# EAGLE design AP-Taster_V3.3 (EAGLE 6.3)
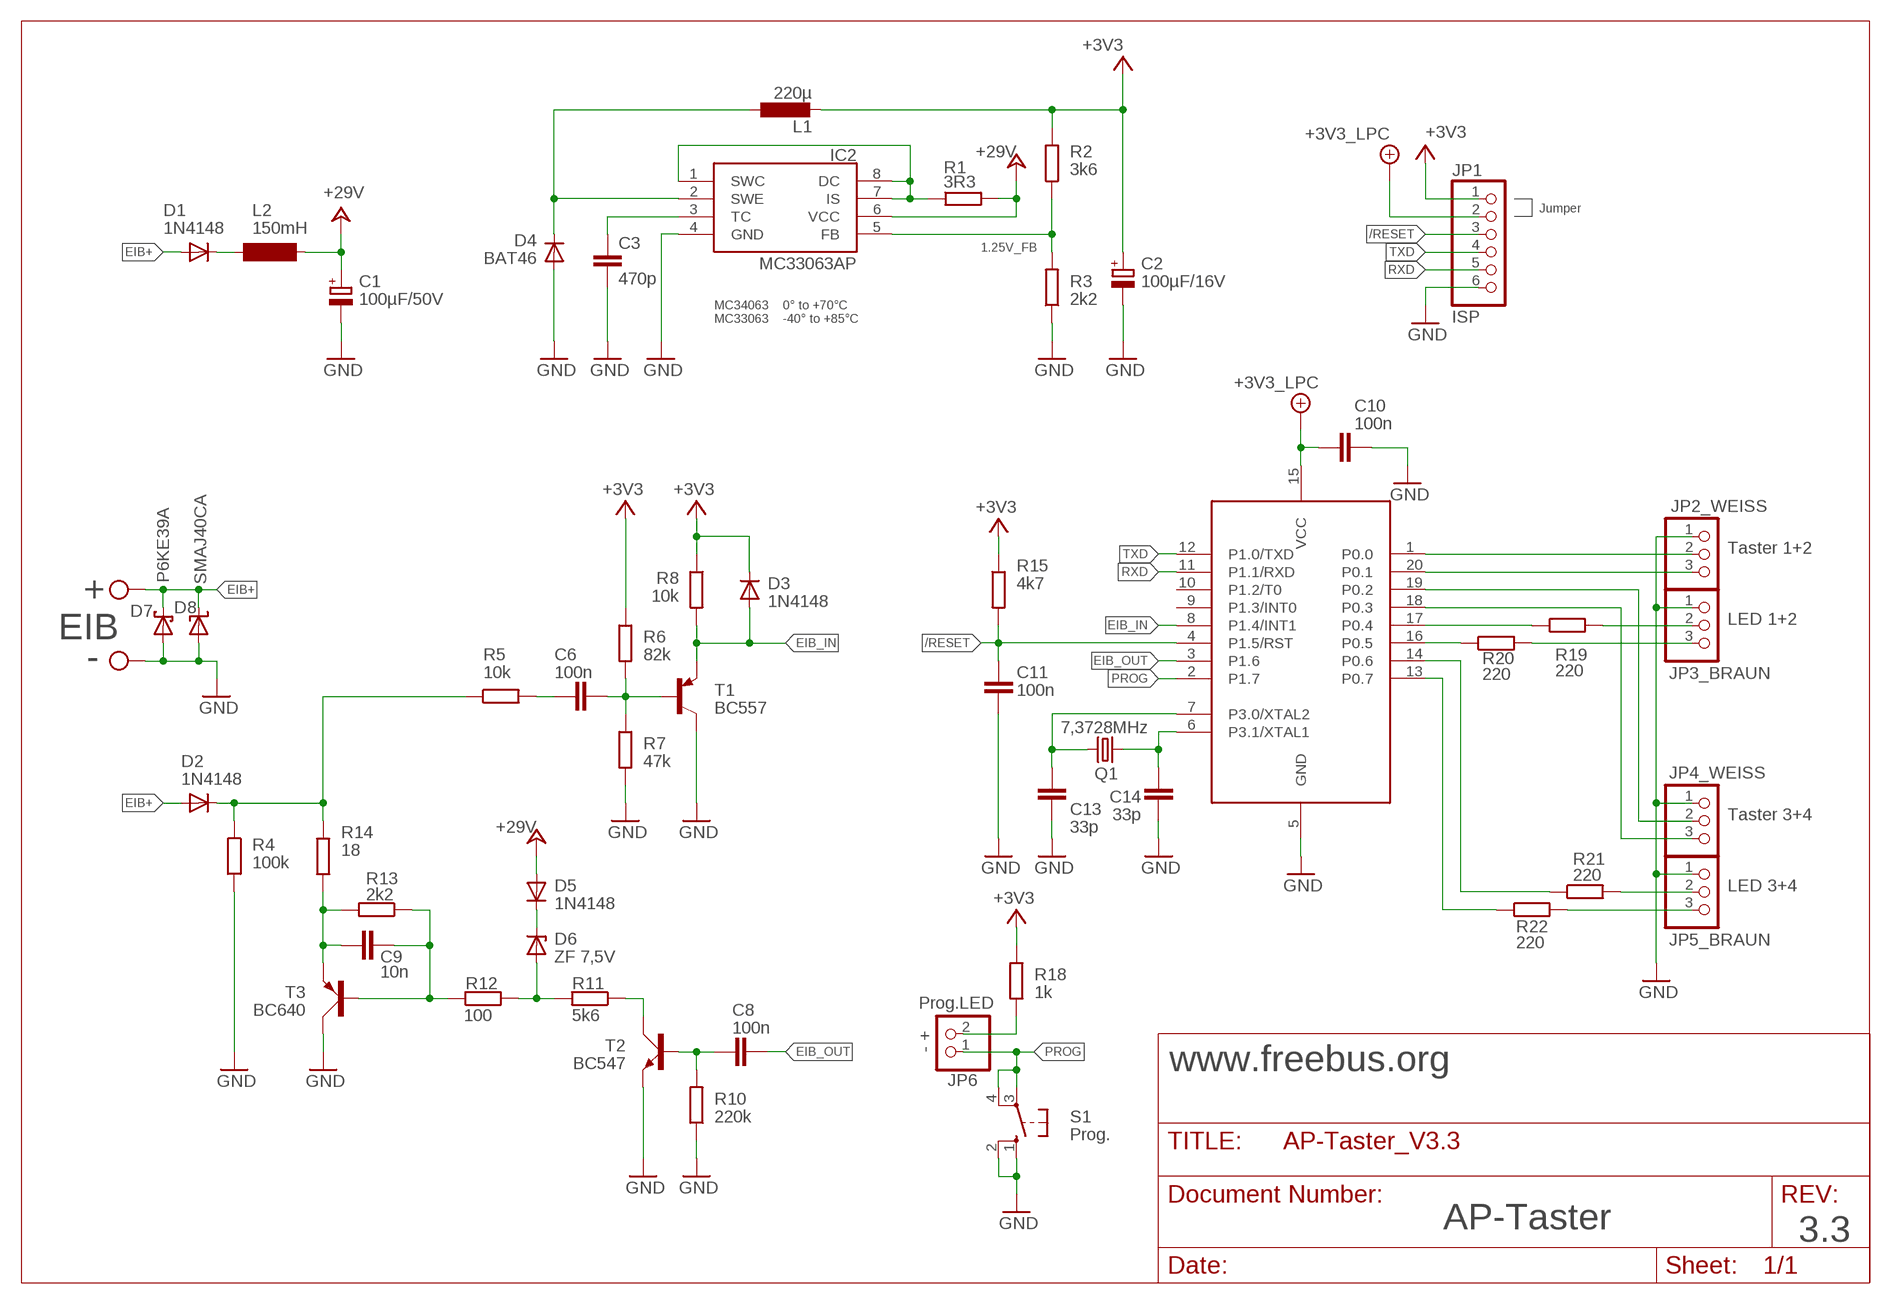
[diagram p0: schematic, sheet 1]

## Parts
C1  100µF/50V  CPOL-EUE3.5-8  [E3,5-8]
C2  100µF/16V  CPOL-EUE2-5  [E2-5]
C3  470p  C-EU025-024X044  [C025-024X044]
C6  100n  C-EU050-024X044  [C050-024X044]
C8  100n  C-EU050-024X044  [C050-024X044]
C9  10n  C-EU025-024X044  [C025-024X044]
C10  100n  C-EU025-024X044  [C025-024X044]
C11  100n  C-EU025-024X044  [C025-024X044]
C13  33p  C-EU025-024X044  [C025-024X044]
C14  33p  C-EU025-024X044  [C025-024X044]
D1  1N4148  DIODE-DO34-7R  [DO34-7R]
D2  1N4148  DIODE-DO34-7R  [DO34-7R]
D3  1N4148  DIODE-DO34-7R  [DO34-7R]
D4  BAT46  DIODE-DO34-7R  [DO34-7R]
D5  1N4148  DIODE-DO34-7R  [DO34-7R]
D6  ZF 7,5V  ZENER-DIODEDO34Z7R  [DO34Z7R]
D7  P6KE39A  P6KEXX7MM  [DO35-7G]
D8  SMAJ40CA  SUPPRESSOR-SMBJ  [SMBJ]
IC1  89LPC922  [DIL20]
IC2  MC33063AP  MC34063AP  [DIL08]
JP1  ISP  PINHD-1X6  [1X06]
JP2_WEISS  Taster 1+2  PINHD-1X3CON  [1X03_CONNECTOR]
JP3_BRAUN  LED 1+2  PINHD-1X3CON  [1X03_CONNECTOR]
JP4_WEISS  Taster 3+4  PINHD-1X3CON  [1X03_CONNECTOR]
JP5_BRAUN  LED 3+4  PINHD-1X3CON  [1X03_CONNECTOR]
JP6  Prog.LED  PINHD-1X2CON  [1X02_CONNECTOR]
L1  220µ  L-EU0207/10  [0207/10]
L2  150mH  BS11  [BS11]
Q1  7,3728MHz  CRYSTALHC49S  [HC49/S]
R1  3R3  R-EU_0207/7  [0207/7]
R2  3k6  R-EU_0207/7  [0207/7]
R3  2k2  R-EU_0207/7  [0207/7]
R4  100k  R-EU_0207/7  [0207/7]
R5  10k  R-EU_0207/7  [0207/7]
R6  82k  R-EU_0207/7  [0207/7]
R7  47k  R-EU_0207/7  [0207/7]
R8  10k  R-EU_0207/7  [0207/7]
R10  220k  R-EU_0207/7  [0207/7]
R11  5k6  R-EU_0207/7  [0207/7]
R12  100  R-EU_0207/7  [0207/7]
R13  2k2  R-EU_0207/7  [0207/7]
R14  18  R-EU_0207/7  [0207/7]
R15  4k7  R-EU_0207/7  [0207/7]
R18  1k  R-EU_0207/7  [0207/7]
R19  220  R-EU_0207/7  [0207/7]
R20  220  R-EU_0207/7  [0207/7]
R21  220  R-EU_0207/7  [0207/7]
R22  220  R-EU_0207/7  [0207/7]
S1  Prog.  10-XX  [B3F-10XX]
T1  BC557  [TO92]
T2  BC547  [SOT54A]
T3  BC640  [SOT54D]
X1  EIB  W237-102  [W237-102]

## Nets
1.25V_FB: IC2.5(FB) R2.1 R3.2
+3V3: C2.+ D3.C JP1.1 L1.2 R2.2 R6.1 R8.1 R15.1 R18.1
+3V3_LPC: C10.2 IC1.15(VCC) JP1.2
+29V: C1.+ D5.A IC2.6(VCC) L2.2 R1.2
/RESET: C11.2 IC1.4(P1.5/RST) JP1.3 R15.2
BASE1: C6.2 R6.2 R7.1 T1.2(B)
EIB+: D1.A D2.A D7.C D8.C X1.2
EIB_IN: D3.A IC1.8(P1.4/INT1) R8.2 T1.1(E)
EIB_OUT: C8.2 IC1.3(P1.6)
FETGATE1: C8.1 R10.2 T2.B
GND: C1.- C2.- C3.2 C10.1 C11.1 C13.2 C14.2 D4.A D7.A D8.A IC1.5(GND) IC2.4(GND) JP1.6 JP2_WEISS.1 JP3_BRAUN.1 JP4_WEISS.1 JP5_BRAUN.1 R3.1 R4.2 R7.2 R10.1 S1.1(S) S1.2(S1) T1.3(C) T2.E T3.C X1.1
IO_1: IC1.1(P0.0) JP2_WEISS.2
IO_2: IC1.20(P0.1) JP2_WEISS.3
IO_3: IC1.19(P0.2) JP4_WEISS.2
IO_4: IC1.18(P0.3) JP4_WEISS.3
IO_5: IC1.17(P0.4) R19.1
IO_6: IC1.16(P0.5) R20.1
IO_7: IC1.14(P0.6) R21.1
IO_8: IC1.13(P0.7) R22.1
LED_1: JP3_BRAUN.2 R19.2
LED_2: JP3_BRAUN.3 R20.2
LED_3: JP5_BRAUN.2 R21.2
LED_4: JP5_BRAUN.3 R22.2
N$5: D2.C R4.1 R5.1 R14.1
N$7: JP6.2 R18.2
N$8: IC2.1(SWC) IC2.7(IS) IC2.8(DC) R1.1
N$11: D4.C IC2.2(SWE) L1.1
N$12: C3.1 IC2.3(TC)
N$13: D1.C L2.1
N$14: D5.C D6.C
N$15: D6.A R11.2 R12.2
N$16: C9.1 R12.1 R13.1 T3.B
N$18: C9.2 R13.2 R14.2 T3.E
N$22: C6.1 R5.2
N$34: R11.1 T2.C
PROG: IC1.2(P1.7) JP6.1 S1.3(P) S1.4(P1)
RXD: IC1.11(P1.1/RXD) JP1.5
TXD: IC1.12(P1.0/TXD) JP1.4
XTAL1: C14.1 IC1.6(P3.1/XTAL1) Q1.1
XTAL2: C13.1 IC1.7(P3.0/XTAL2) Q1.2
Unconnected: IC1.9(P1.3/INT0) IC1.10(P1.2/T0)

## Notes on the sheet
- Jumper
- MC34063    0° to +70°C
  MC33063    -40° to +85°C
- +
- -
- - +
- www.freebus.org
- AP-Taster
- 3.3

## Library data of the parts
C1 C2 = rcl:CPOL-EU: POLARIZED CAPACITOR, European symbol
C3 C6 C8-C11 C13 C14 = rcl:C-EU: CAPACITOR, European symbol
D1-D5 = diode:DIODE-: DIODE
D6 = diode:ZENER-DIODE: Z-Diode
D7 = diode:P6KEXX: DIODE transient-voltage suppressor
D8 = diode:SUPPRESSOR-: Suppressor diode
IC1 = micro-philips:89LPC922
IC2 = mc34063:MC34063
JP1 = pinhead:PINHD-1X6: PIN HEADER
JP2_WEISS JP3_BRAUN JP4_WEISS JP5_BRAUN = pinhead:PINHD-1X3: PIN HEADER
JP6 = pinhead:PINHD-1X2: PIN HEADER
L1 = rcl:L-EU: INDUCTOR, European symbol
L2 = inductor-neosid:BS: INDUCTOR nominal inductance, magnetically screened; OC_FARNELL: unknown; OC_NEWARK: unknown
Q1 = crystal:CRYSTAL: CRYSTAL; OC_FARNELL: 1667008; OC_NEWARK: unknown
R1-R8 R10-R15 R18-R22 = rcl:R-EU_: RESISTOR, European symbol
S1 = switch-omron:10-XX: OMRON SWITCH; MPN: B3F-1000; OC_FARNELL: 176432; OC_NEWARK: 36M3542
T1 = transistor-pnp:BC557: PNP Transistor
T2 = transistor-small-signal:BC547: NPN TRANSISTOR
T3 = transistor-small-signal:BC640: PNP TRANSISTOR
X1 = con-wago-500:W237-102: WAGO SCREW CLAMP; MPN: 237-102; OC_FARNELL: unknown; OC_NEWARK: 70K9898

## Board
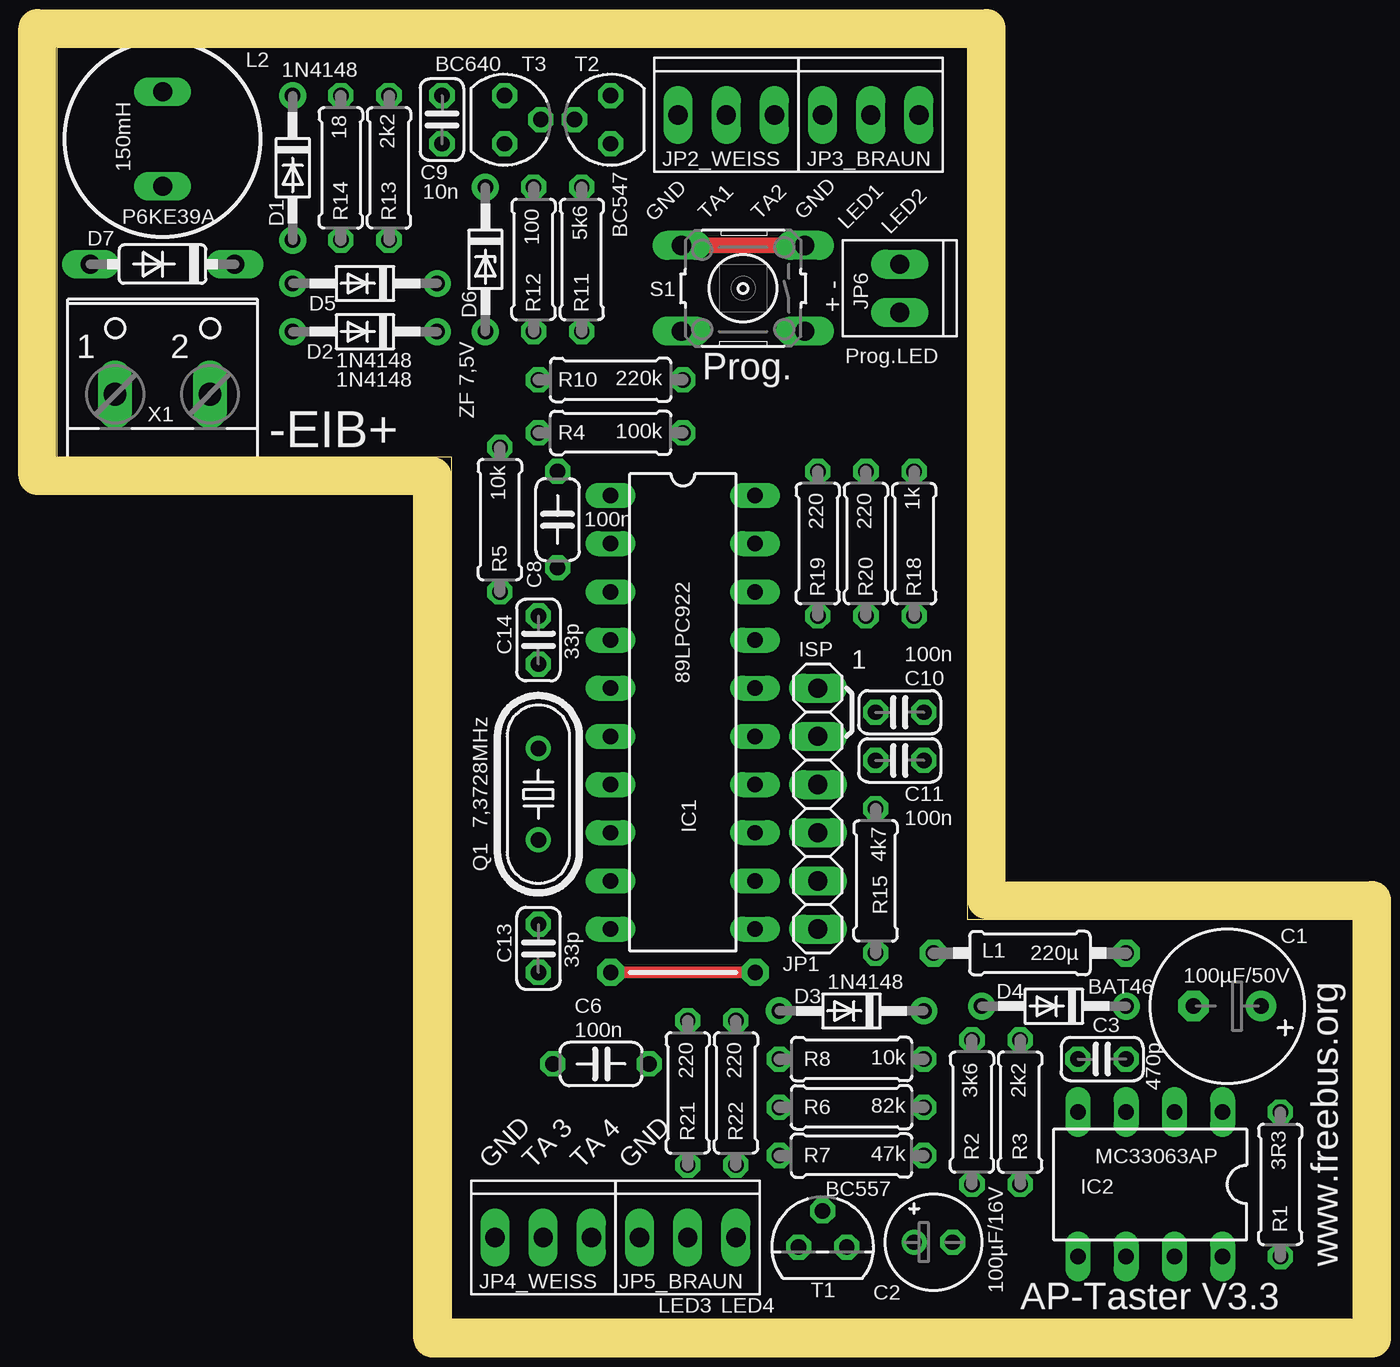
[diagram p1: board, top side]
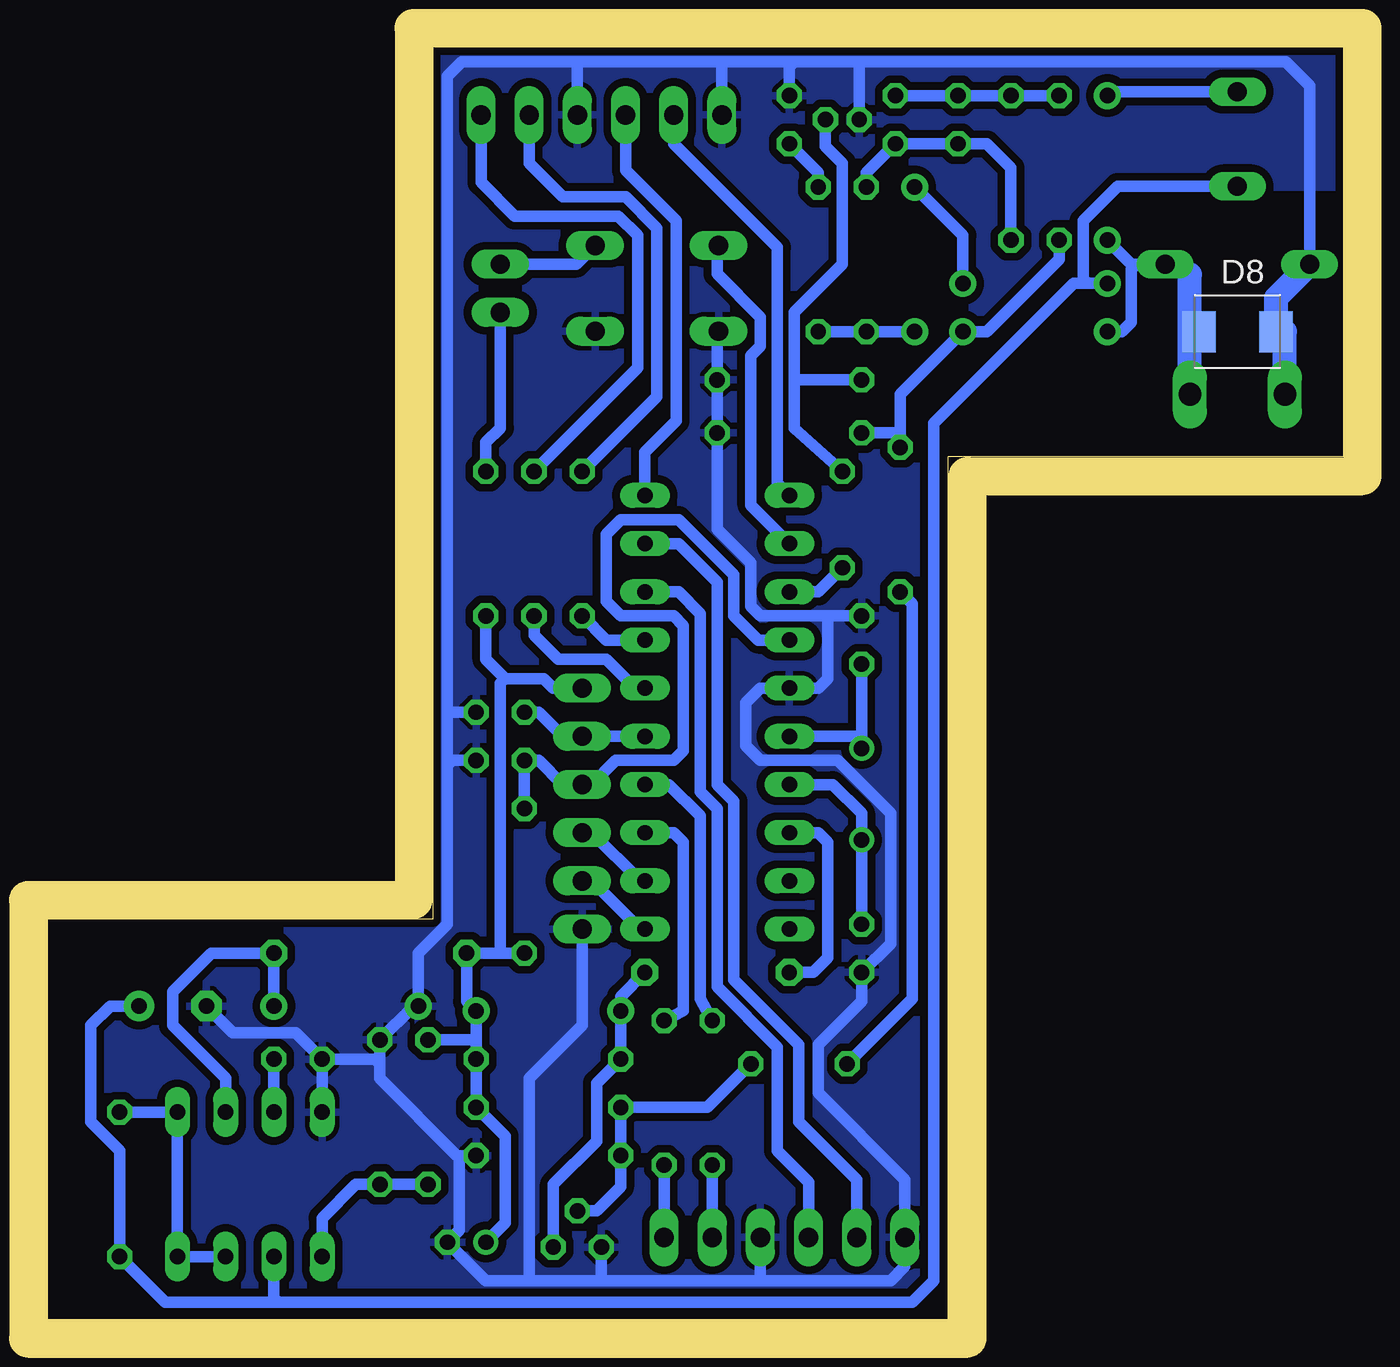
[diagram p2: board, bottom side, seen from below]

Size 68.33 x 67.06 mm. Coordinates in mm from the lower left corner, seen from the top.
Outline: 20.83,0 20.83,45.47 0,45.47 0,67.06 48.01,67.06 48.01,21.08 68.33,21.08 68.33,0 20.83,0
Copper layers (1*16): Top 0.035mm / dielectric 1.5mm / Bottom 0.035mm
Design rules "default": minimum track width 6mil, minimum drill 12mil, track to track 6mil, track to pad 6mil, pad to pad 6mil, via to via 6mil, smd to smd 0mil, copper to edge 10mil, drill to drill 10mil, minimum pad ring 10mil, minimum via ring 6mil, stop-mask expansion 2mil, vias tented up to drill 100mil, thermal gap 10mil
Milling: 8 lines

### Footprints (pad centres in the part's own frame; a part is rotated, then mirrored left to right if it is on the bottom)
E3,5-8 = drill 0.813 pad 1.6: + -1.778,0 | drill 0.813 pad 1.6 octagon: - 1.778,0
E2-5 = drill 0.813 pad 1.27: + -1.016,0 | drill 0.813 pad 1.27 octagon: - 1.016,0
C025-024X044 = drill 0.813 octagon: 1 -1.27,0; 2 1.27,0
C050-024X044 = drill 0.813 octagon: 1 -2.54,0; 2 2.54,0
DO34-7R = drill 0.813 pad 1.422: A 3.81,0; C -3.81,0
DO34Z7R = drill 0.813 pad 1.422: A 3.81,0; C -3.81,0
DO35-7G = drill 1 long: A 3.81,0; C -3.81,0
SMBJ = smd 1.78 x 2.16: A 2.04,0; C -2.03,0
DIL20 = drill 0.813 long: 1 -11.43,-3.81; 2 -8.89,-3.81; 3 -6.35,-3.81; 4 -3.81,-3.81; 5 -1.27,-3.81; 6 1.27,-3.81; 7 3.81,-3.81; 8 6.35,-3.81; 9 8.89,-3.81; 10 11.43,-3.81; 11 11.43,3.81; 12 8.89,3.81; 13 6.35,3.81; 14 3.81,3.81; 15 1.27,3.81; 16 -1.27,3.81; 17 -3.81,3.81; 18 -6.35,3.81; 19 -8.89,3.81; 20 -11.43,3.81
DIL08 = drill 0.813 long: 1 -3.81,-3.81; 2 -1.27,-3.81; 3 1.27,-3.81; 4 3.81,-3.81; 5 3.81,3.81; 6 1.27,3.81; 7 -1.27,3.81; 8 -3.81,3.81
1X06 = drill 1.016 long: 1 -6.35,0; 2 -3.81,0; 3 -1.27,0; 4 1.27,0; 5 3.81,0; 6 6.35,0
1X03_CONNECTOR = drill 1.016 long: 1 -2.54,0; 2 0,0; 3 2.54,0
1X02_CONNECTOR = drill 1.016 long: 1 -1.27,0; 2 1.27,0
0207/10 = drill 0.813 pad 1.422 octagon: 1 -5.08,0; 2 5.08,0
BS11 = drill 1 long: 1 -2.5,0; 2 2.5,0
HC49/S = drill 0.813: 1 -2.413,0; 2 2.413,0
0207/7 = drill 0.813 octagon: 1 -3.81,0; 2 3.81,0
B3F-10XX = drill 1.016 long: 1 -3.251,2.261; 2 3.251,2.261; 3 -3.251,-2.261; 4 3.251,-2.261
TO92 = drill 0.813 octagon: 1 1.27,0; 2 0,1.905; 3 -1.27,0
SOT54A = drill 0.813 octagon: B 0,1.905; C -1.27,0; E 1.27,0
SOT54D = drill 0.813 octagon: B 1.27,0; C 0,1.905; E -1.27,0
W237-102 = drill 1.194 long: 1 -2.5,-1.27; 2 2.5,-1.27

### Placement (x,y rotation side)
C1  61.72,16.51 180 top
C2  46.23,4.06 0 top
C3  55.12,13.72 180 top
C6  28.7,13.46 0 top
C8  26.42,42.16 270 top
C9  20.32,63.25 90 top
C10  44.45,32 180 top
C11  44.45,29.46 180 top
C13  25.4,19.56 270 top
C14  25.4,35.81 90 top
D1  12.45,60.71 270 top
D2  16.26,52.07 180 top
D3  41.91,16.26 180 top
D4  52.58,16.51 180 top
D5  16.26,54.61 180 top
D6  22.61,55.88 270 top
D7  5.59,55.63 180 top
D8  5.59,52.07 0 bottom
IC1  33.02,32 270 top
IC2  57.66,7.11 180 top
JP1  40.13,26.92 270 top
JP2_WEISS  35.31,63.5 0 top
JP3_BRAUN  42.93,63.5 0 top
JP4_WEISS  25.65,4.32 0 top
JP5_BRAUN  33.27,4.32 0 top
JP6  44.45,54.36 270 top
L1  51.31,19.3 180 top
L2  5.59,62.23 270 top
Q1  25.4,27.69 270 top
R1  64.52,7.11 270 top
R2  48.26,10.92 90 top
R3  50.8,10.92 270 top
R4  29.21,46.74 0 top
R5  23.37,42.16 270 top
R6  41.91,11.18 180 top
R7  41.91,8.64 0 top
R8  41.91,13.72 180 top
R10  29.21,49.53 180 top
R11  27.69,55.88 270 top
R12  25.15,55.88 270 top
R13  17.53,60.71 90 top
R14  14.99,60.71 90 top
R15  43.18,23.11 90 top
R18  45.21,40.89 90 top
R19  40.13,40.89 90 top
R20  42.67,40.89 90 top
R21  33.27,11.94 270 top
R22  35.81,11.94 270 top
S1  36.2,54.36 180 top
T1  40.39,3.81 0 top
T2  29.21,63.25 90 top
T3  23.62,63.25 270 top
X1  5.59,50.04 0 top

### Tracks (layer width: path | path; a pad name or v marks a point on that pad's centre or on a via)
1.25V_FB
  Bottom 0.61: IC2.5 53.85,5.33 52.07,7.11 R3.2 R2.1
+3V3
  Bottom 0.61: 45.72,14.73 R8.1 R6.1 44.2,9.65 44.2,5.08 C2.+ | 45.72,14.73 D3.C 46.23,16.76 L1.2 R15.1 44.45,19.3 44.45,25.91 44.45,33.53 44.2,33.78 | 44.2,33.78 42.16,33.78 41.66,33.27 JP1.1 | 44.2,33.78 45.21,34.8 R18.1 | R2.2 45.72,14.73
+3V3_LPC
  Bottom 0.61: IC1.15 JP1.2 41.15,30.73 42.42,32 C10.2
+29V
  Bottom 0.61: 13.46,54.61 14.22,54.61 21.59,47.24 21.59,2.03 22.73,0.89 56.13,0.89 | 13.46,54.61 D5.A | 13.46,54.61 13.72,54.86 13.72,57.91 11.9,59.73 L2.2 | 56.13,0.89 62.1,0.89 R1.2 64.52,8.89 66.04,10.41 66.04,15.49 65.02,16.51 C1.+ | IC2.6 56.39,1.14 56.13,0.89
/RESET
  Bottom 0.61: IC1.4 30.86,35.81 32.13,37.08 32.13,39.24 35.05,42.16 38.1,42.16 38.86,41.4 38.86,37.85 38.1,37.08 35.31,37.08 34.8,36.58 34.8,29.97 35.31,29.46 38.35,29.46 39.62,28.19 JP1.3 41.15,28.19 42.42,29.46 C11.2 R15.2
BASE1
  Bottom 0.61: C6.2 33.53,11.18 R6.2 R7.1 38.1,6.99 39.37,5.71 T1.2
EIB+
  Bottom 0.61: D8.C 7.83,51.56 8.09,51.82 | D1.A 11.18,55.63 10.92,55.63 | 10.92,55.63 D7.C | 8.09,55.08 8.64,55.63 | D2.A 11.68,52.07 11.18,52.58 11.18,55.37 10.92,55.63
  Bottom 1.27: X1.2 8.09,51.82 8.09,55.08 | 8.64,55.63 D7.C
EIB_IN  (via drill 0.8 pad 1.42)
  Top 0.61: v29.21,18.29 v36.83,18.29
  Bottom 0.61: IC1.8 27.69,25.65 27.18,25.15 27.18,19.05 27.94,18.29 v29.21,18.29 | 36.83,18.03 v36.83,18.29 38.1,17.02 D3.A R8.2 39.37,12.45 39.37,9.4 41.66,7.11 T1.1
EIB_OUT
  Bottom 0.61: IC1.3 27.69,38.35 C8.2
FETGATE1
  Bottom 0.61: C8.1 28.96,46.99 28.96,49.53 | 28.96,49.53 28.96,53.09 26.42,55.63 26.42,60.96 27.3,61.85 T2.B | R10.2 28.96,49.53
GND
  Bottom 0.61: 3.09,52.07 D8.A | D7.A 1.78,65.02 3.05,66.29 25.65,66.29 | T3.C 25.53,66.17 25.65,66.29 | 25.65,66.29 28.96,66.29 | 28.96,66.29 32.77,66.29 | 32.77,66.29 40.39,66.29 | 40.39,66.29 46.48,66.29 47.24,65.53 47.24,32 | 47.24,32 47.24,29.21 | 47.24,29.21 47.24,20.83 48.77,19.3 D4.A 49.02,16.51 R3.1 50.8,13.46 | T2.E 29.21,66.04 28.96,66.29 | JP2_WEISS.1 32.77,66.29 | JP3_BRAUN.1 40.39,66.29 | S1.2 33.02,52.02 R10.1 R4.2 33.02,41.66 31.24,39.88 31.24,37.59 30.73,37.08 27.18,37.08 | C10.1 47.24,32 | C11.1 46.99,29.46 47.24,29.21 | C1.- 58.55,15.11 55.24,15.11 C3.2 | C3.2 IC2.4 | 46.61,8.64 46.74,8.64 50.8,12.7 50.8,13.46 | 46.61,8.64 R7.2 | C3.2 51.05,13.72 50.8,13.46 | 30.73,2.03 23.88,2.03 23.11,2.79 JP4_WEISS.1 23.11,7.37 27.69,11.94 27.69,14.48 25.4,16.76 C13.2 23.88,19.81 23.88,26.67 26.67,29.46 30.73,29.46 31.5,30.23 31.5,32.51 30.73,33.27 IC1.5 27.69,33.27 27.18,33.78 27.18,37.08 | 30.73,2.03 39.12,2.03 | 39.12,2.03 42.93,2.03 | T1.3 39.12,2.03 | JP5_BRAUN.1 30.73,2.03 | JP1.6 40.13,15.49 42.93,12.7 42.93,2.03 | 27.18,37.08 C14.2 | 46.61,8.64 46.61,4.7 C2.- 45.21,2.03 42.93,2.03
  Bottom 1.27: X1.1 3.09,52.07 | D8.A 3.55,53.86 D7.A
  pour Bottom (isolate 0.406): 20.83,45.47 20.83,0 68.33,0 68.33,21.08 48.01,21.08 48.01,67.06 0,67.06 0,59.69 12.45,59.69 12.45,45.47
IO_1
  Bottom 0.61: IC1.1 29.84,44.07 29.84,56.52 35.31,61.98 JP2_WEISS.2
IO_2
  Bottom 0.61: IC1.20 36.83,45.72 35.18,47.37 35.18,57.91 37.85,60.58 JP2_WEISS.3
IO_3
  Bottom 0.61: IC1.19 35.05,40.89 33.02,38.86 33.02,28.19 32.13,27.3 32.13,17.91 28.7,14.48 28.7,10.41 25.65,7.37 JP4_WEISS.2
IO_4
  Bottom 0.61: IC1.18 35.05,38.35 33.91,37.21 33.91,27.81 33.02,26.92 33.02,17.53 29.84,14.35 29.84,8.89 28.19,7.24 JP4_WEISS.3
IO_5
  Bottom 0.61: IC1.17 38.86,35.81 R19.1
IO_6
  Bottom 0.61: IC1.16 37.34,33.27 38.86,34.8 41.4,34.8 42.67,36.07 R20.1
IO_7
  Bottom 0.61: IC1.14 35.56,28.19 33.91,26.54 33.91,16.89 R21.1
IO_8
  Bottom 0.61: IC1.13 35.31,25.65 34.8,25.15 34.8,16.26 R22.1
LED_1
  Bottom 0.61: R19.2 36.2,48.64 36.2,57.53 37.85,59.18 41.15,59.18 42.93,60.96 JP3_BRAUN.2
LED_2
  Bottom 0.61: R20.2 37.21,50.16 37.21,57.15 38.23,58.17 43.69,58.17 45.47,59.94 JP3_BRAUN.3
LED_3
  Bottom 0.61: JP5_BRAUN.2 R21.2
LED_4
  Bottom 0.61: JP5_BRAUN.3 R22.2
N$5
  Bottom 0.61: R14.1 14.99,55.88 18.8,52.07 D2.C 23.37,48.77 23.37,46.74 | 23.37,46.74 R5.1 | R4.1 23.37,46.74
N$7
  Bottom 0.61: R18.2 45.21,46.23 44.45,46.99 JP6.2
N$8
  Bottom 0.61: R1.1 IC2.1 IC2.8 IC2.7
N$11
  Bottom 0.61: IC2.2 58.93,12.7 61.72,15.49 61.72,17.27 59.69,19.3 L1.1 D4.C
N$12
  Bottom 0.61: C3.1 IC2.3
N$13
  Bottom 0.61: D1.C 12.23,64.73 L2.1
N$14
  Bottom 0.61: D5.C 20.07,57.15 D6.C
N$15
  Bottom 0.61: D6.A R12.2 R11.2
N$16
  Bottom 0.61: R13.1 17.53,60.71 18.8,61.98 C9.1 T3.B 25.15,60.45 R12.1
N$18
  Bottom 0.61: R14.2 R13.2 C9.2 T3.E
N$22
  Bottom 0.61: R5.2 22.73,37.72 22.73,16.89 C6.1
N$34
  Bottom 0.61: R11.1 27.69,60.45 T2.C
PROG
  Top 0.813: S1.3 S1.4
  Bottom 0.61: IC1.2 31.24,42.93 31.24,50.8 30.73,51.31 30.73,52.83 33.02,55.12 33.02,56.54 S1.4 | JP6.1 40.44,55.63 S1.3
RXD
  Bottom 0.61: IC1.11 37.08,20.57 39.62,23.11 JP1.5
TXD
  Bottom 0.61: IC1.12 37.08,23.11 39.62,25.65 JP1.4
XTAL1
  Bottom 0.61: Q1.1 25.4,30.73 | C14.1 25.4,30.99 25.4,30.73 | IC1.6 25.4,30.73
XTAL2
  Bottom 0.61: C13.1 Q1.2 25.4,26.67 26.92,28.19 IC1.7

### Text on the board
tPlace: GND | TA1 | TA2 | GND | LED1 | LED2 | + - | Prog. | -EIB+ | 1 | GND | TA 3 | TA 4 | GND | www.freebus.org | LED3 | LED4 | AP-Taster V3.3